# Altium schematic sheet 电机驱动.SchDoc
size A3
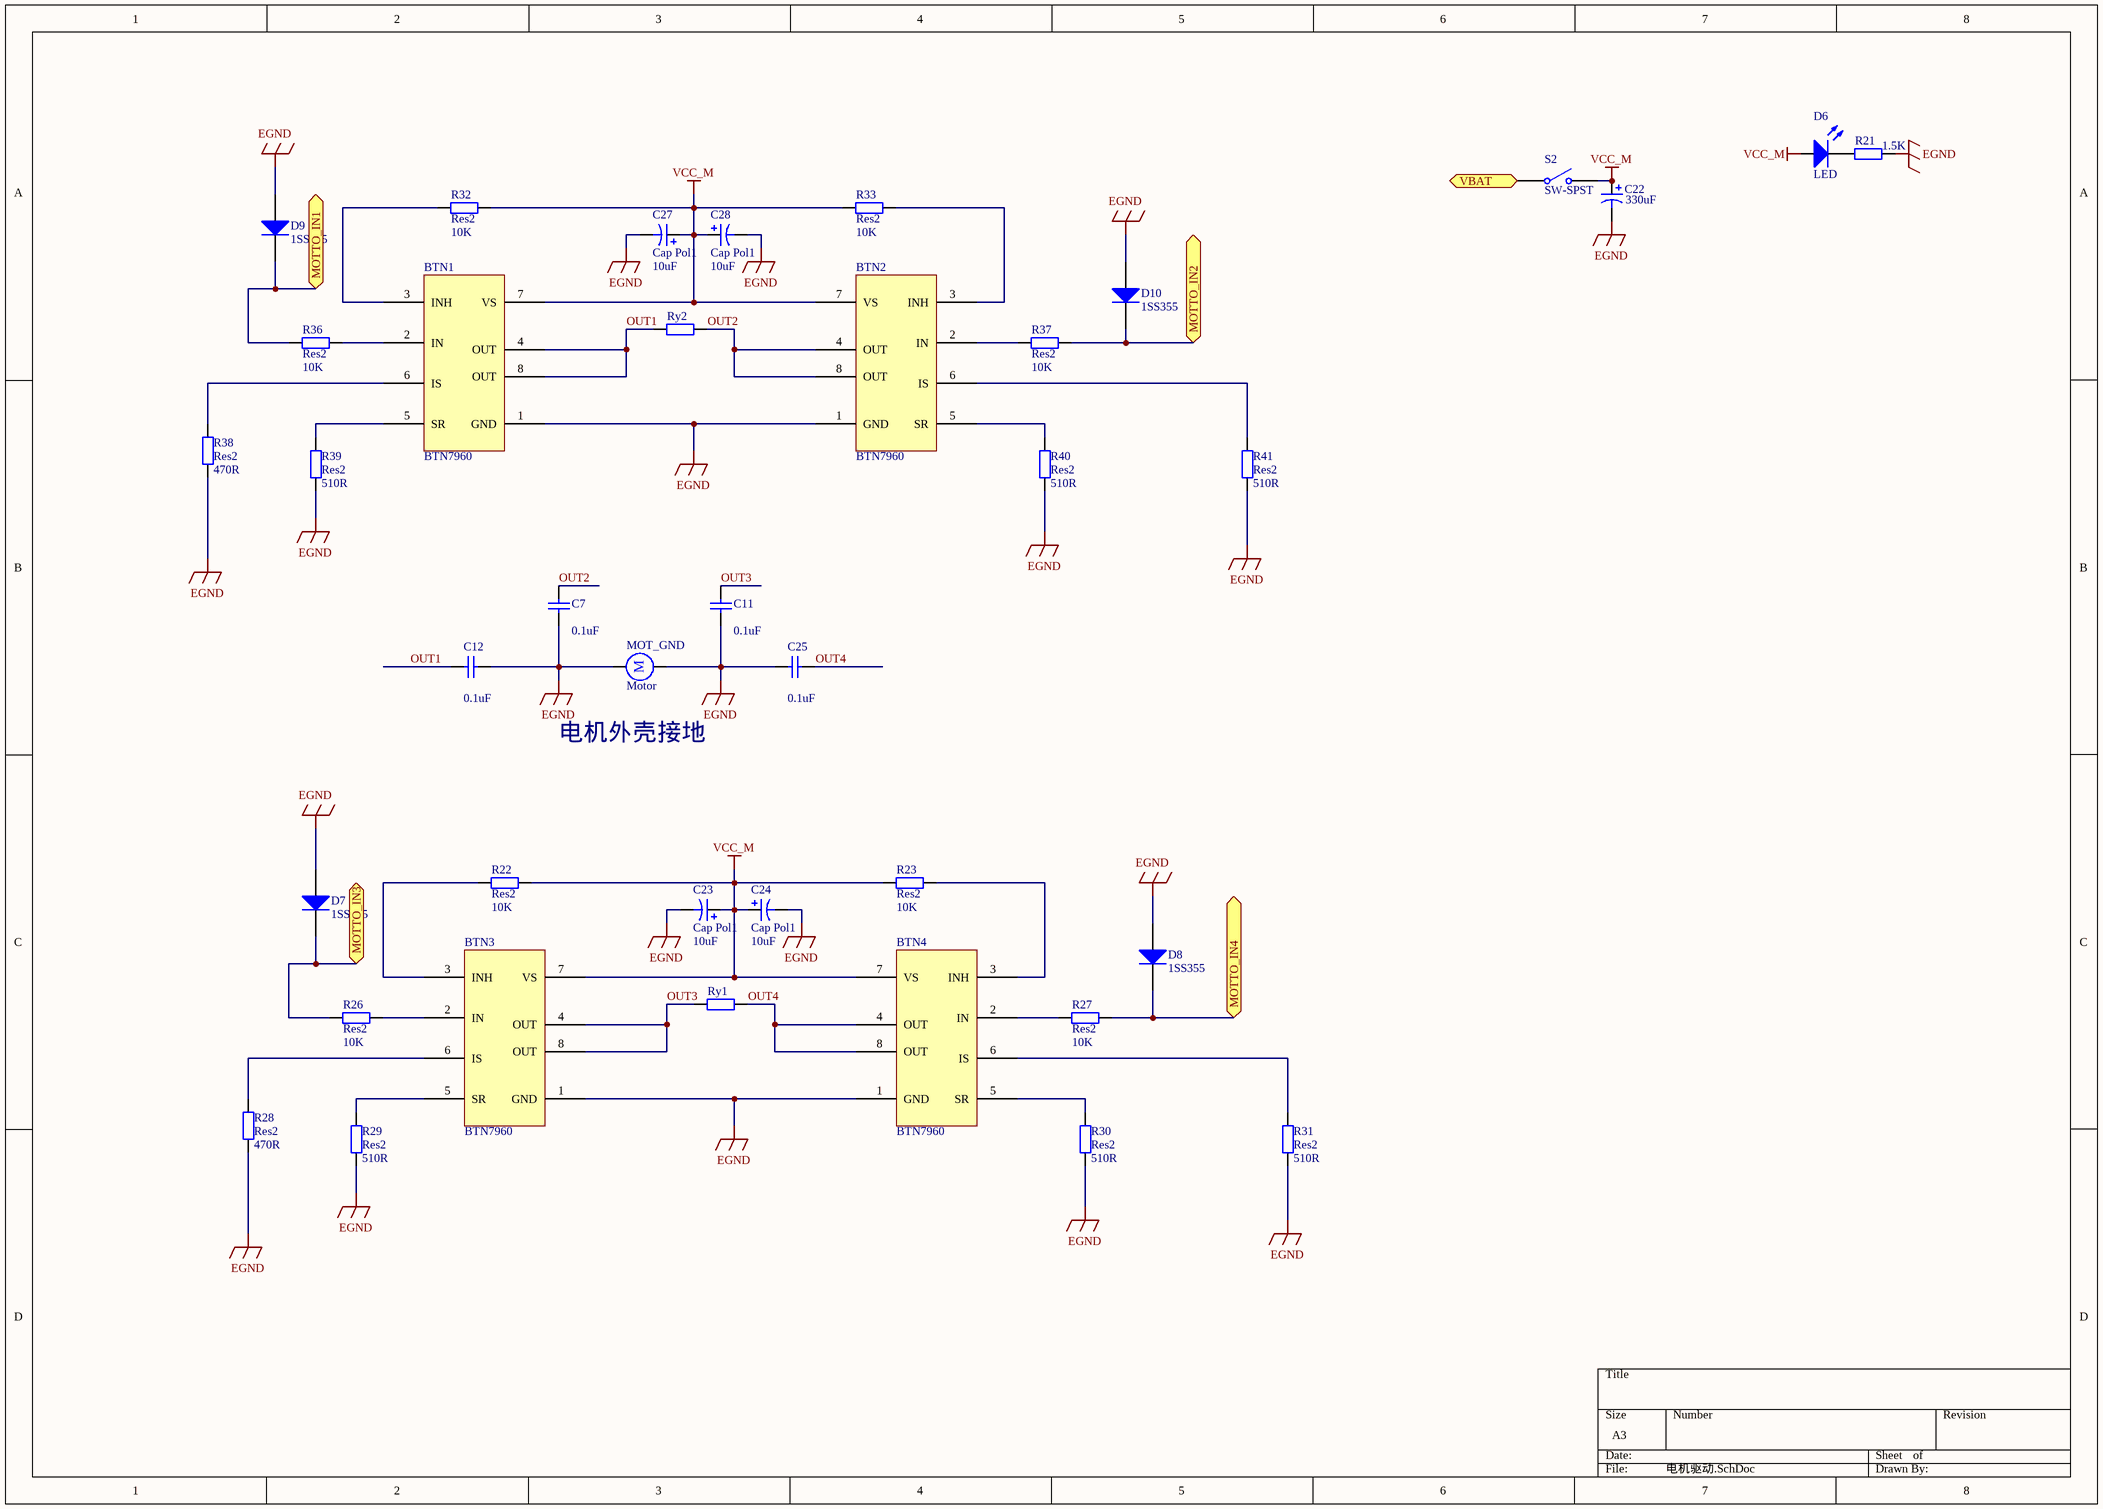
[diagram p0: 电机驱动.SchDoc]

## Parts
BTN1  BTN7960  [PG-TO263-7-1]
BTN2  BTN7960  [PG-TO263-7-1]
BTN3  BTN7960  [PG-TO263-7-1]
BTN4  BTN7960  [PG-TO263-7-1]
C7  value 0.1uF  [C2012]  (hidden comment: Cap)
C11  value 0.1uF  [C2012]  (hidden comment: Cap)
C12  value 0.1uF  [C2012]  (hidden comment: Cap)
C22  value 330uF  [SMD-EC-F12.5]  (hidden comment: Cap Pol1)
C23  Cap Pol1  value 10uF  [1206(2)]
C24  Cap Pol1  value 10uF  [1206(2)]
C25  value 0.1uF  [C2012]  (hidden comment: Cap)
C27  Cap Pol1  value 10uF  [1206(2)]
C28  Cap Pol1  value 10uF  [1206(2)]
D6  LED  [C2012]
D7  1SS355  [1206(2)]
D8  1SS355  [1206(2)]
D9  1SS355  [1206(2)]
D10  1SS355  [1206(2)]
MOT_GND  Motor  [KF301-2P]
R21  value 1.5K  [R2012]  (hidden comment: Res2)
R22  Res2  value 10K  [R2012]
R23  Res2  value 10K  [R2012]
R26  Res2  value 10K  [R2012]
R27  Res2  value 10K  [R2012]
R28  Res2  value 470R  [R2012]
R29  Res2  value 510R  [R2012]
R30  Res2  value 510R  [R2012]
R31  Res2  value 510R  [R2012]
R32  Res2  value 10K  [R2012]
R33  Res2  value 10K  [R2012]
R36  Res2  value 10K  [R2012]
R37  Res2  value 10K  [R2012]
R38  Res2  value 470R  [R2012]
R39  Res2  value 510R  [R2012]
R40  Res2  value 510R  [R2012]
R41  Res2  value 510R  [R2012]
Ry1  (no value)  [1206(2)]
Ry2  (no value)  [1206(2)]
S2  SW-SPST  [SW-125V6A(-)]

## Ports
MOTTO_IN1, MOTTO_IN2, MOTTO_IN3, MOTTO_IN4, VBAT

## Nets
EGND: BTN1.1(GND) BTN2.1(GND) BTN3.1(GND) BTN4.1(GND) C7.2 C11.2 C12.2 C22.2 C23.2 C24.2 C25.1 C27.2 C28.2 D7.1(A) D8.1(A) D9.1(A) D10.1(A) MOT_GND.1 MOT_GND.2 R21.1 R28.1 R29.1 R30.1 R31.1 R38.1 R39.1 R40.1 R41.1
VCC_M: BTN1.7(VS) BTN2.7(VS) BTN3.7(VS) BTN4.7(VS) C22.1 C23.1 C24.1 C27.1 C28.1 D6.1 R22.2 R23.1 R32.2 R33.1 S2.2(NO)
MOTTO_IN1: D9.2(K) R36.1 ; port MOTTO_IN1
MOTTO_IN2: D10.2(K) R37.2 ; port MOTTO_IN2
MOTTO_IN3: D7.2(K) R26.1 ; port MOTTO_IN3
MOTTO_IN4: D8.2(K) R27.2 ; port MOTTO_IN4
OUT1: BTN1.4(OUT) BTN1.8(OUT) C12.1 Ry2.1
OUT2: BTN2.4(OUT) BTN2.8(OUT) C7.1 Ry2.2
OUT3: BTN3.4(OUT) BTN3.8(OUT) C11.1 Ry1.1
OUT4: BTN4.4(OUT) BTN4.8(OUT) C25.2 Ry1.2
VBAT: S2.1(COMMON) ; port VBAT
NetBTN1_2: BTN1.2(IN) R36.2
NetBTN1_3: BTN1.3(INH) R32.1
NetBTN1_5: BTN1.5(SR) R39.2
NetBTN1_6: BTN1.6(IS) R38.2
NetBTN2_2: BTN2.2(IN) R37.1
NetBTN2_3: BTN2.3(INH) R33.2
NetBTN2_5: BTN2.5(SR) R40.2
NetBTN2_6: BTN2.6(IS) R41.2
NetBTN3_2: BTN3.2(IN) R26.2
NetBTN3_3: BTN3.3(INH) R22.1
NetBTN3_5: BTN3.5(SR) R29.2
NetBTN3_6: BTN3.6(IS) R28.2
NetBTN4_2: BTN4.2(IN) R27.1
NetBTN4_3: BTN4.3(INH) R23.2
NetBTN4_5: BTN4.5(SR) R30.2
NetBTN4_6: BTN4.6(IS) R31.2
NetD6_2: D6.2 R21.2

## Notes on the sheet
- 电机外壳接地
- (in symbol Motor) M

## Library data of the parts
C7 C11 C12 C25 = Cap: Capacitor; Published: 8-Jun-2000; LatestRevisionDate: 17-Jul-2002; LatestRevisionNote: Re-released for DXP Platform.; PackageReference: RAD-0.3; Publisher: Altium Limited; PackageDescription: Radial Cap, Thru-Hole; 2 Leads; 0.3 in Pin Spacing
C22-C24 C27 C28 = Cap Pol1: Polarized Capacitor (Radial); Published: 8-Jun-2000; LatestRevisionDate: 17-Jul-2002; LatestRevisionNote: Re-released for DXP Platform.; PackageReference: RB7.6-15; Publisher: Altium Limited; PackageDescription: Polarized Capacitor (Radial); 2 Leads
D6 = LED: Typical INFRARED GaAs LED
D7-D10 = Diode 1N4148: High Conductance Fast Diode; LatestRevisionDate: 17-Jul-2002; LatestRevisionNote: Re-released for DXP Platform.; DatasheetDocument: 1997; PackageReference: DO-35; Publisher: Altium Limited; Code_JEDEC: DO-204-AH; ComponentLink1Description: Manufacturer Link; ComponentLink2Description: Datasheet; ComponentLink2URL: http://www.fairchildsemi.com/ds/1N%2F1N4148.pdf
MOT_GND = Motor: Motor, General Kind
R21-R23 R26-R33 R36-R41 = Res2: Resistor; Published: 8-Jun-2000; LatestRevisionDate: 17-Jul-2002; LatestRevisionNote: Re-released for DXP Platform.; PackageReference: AXIAL-0.4; Publisher: Altium Limited; PackageDescription: Axial Device, Thru-Hole; 2 Leads; 0.4 in Pin Spacing
Ry1 Ry2 = Res: Resistor
S2 = SW-SPST: Single-Pole, Single-Throw Switch; Published: 24-Mar-1999; LatestRevisionDate: 17-Jul-2002; LatestRevisionNote: Re-released for DXP Platform.; PackageReference: SPST-2; Publisher: Altium Limited; PackageDescription: Switch; 2 Leads